# Altium schematic sheet Power_Supply.SchDoc: Document Title
size A4; Author: Designer name; Organization: PIFLab.io; Address1: 18/1A Lanh Binh Thang St.; Address2: Ward 13, District 11; Address3: Ho Chi Minh City; Address4: Vietnam; Revision: rev; SheetNumber: 1; SheetTotal: 4
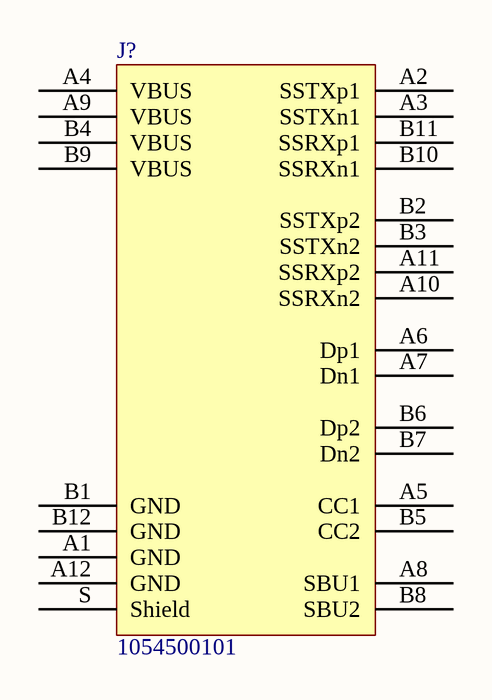
[diagram p0: Power_Supply.SchDoc]

## Parts
J?  1054500101  [Molex 1054500101]

## Nets

Not connected (* = marked no-connect by the designer): J? A1(GND) A2(SSTXp1) A3(SSTXn1) A4(VBUS) A5(CC1) A6(Dp1) A7(Dn1) A8(SBU1) A9(VBUS) A10(SSRXn2) A11(SSRXp2) A12(GND) B1(GND) B2(SSTXp2) B3(SSTXn2) B4(VBUS) B5(CC2) B6(Dp2) B7(Dn2) B8(SBU2) B9(VBUS) B10(SSRXn1) B11(SSRXp1) B12(GND) S(Shield)

## Notes on the sheet
- Document Title:
- Size:
- Date:
- Project Name:
- A4
- Designer:
- Time:
- Revision:
- Sheet
- of
- File:

## Library data of the parts
J? = 1054500101: CONN RCP USB3.1 TYPEC 24P SMD RA; Manufacturer: Molex; Connector Type: USB - C (Type - C); Current Rating (Amps): 0.25A, 1A, 5A; Gender: Receptacle; Mating Cycles: 10000; Number of Contacts: 24; Number of Ports: 1; Shielding: Shielded; Specifications: USB 3.1 (USB 3.1 Gen 2, Superspeed+); Voltage - Rated: 30VAC/DC; Part Number: 1054500101; ComponentLink1Description: Datasheet; ComponentLink1URL: https://www.molex.com/pdm_docs/ps/PS-105448-001.pdf; ComponentLink2Description: DigiKey Link; ComponentLink2URL: http://digikey.com/product-detail/en/molex/1054500101/WM12856CT-ND/5843891; LastUpdated: 06/06/2020 02:14:04; Lifecycle Status: Active; Minimum Order: 1; Mounting Feature: Horizontal; Mounting Type: Surface Mount, Right Angle; Through Hole; Operating Temperature: -30°C ~ 85°C; Packaging: TapeAndReel; Part Status: Active; Price: 1.22; Series: 105445; Supplier 1: DigiKey; Supplier Part Number 1: WM12856CT-ND; Termination: Solder